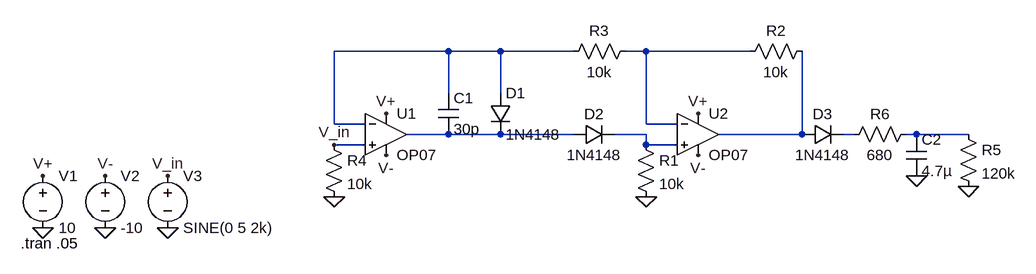
[diagram p0: schematic Draft3.asc]
Draft3.asc, the LTspice schematic file:
Version 4
SHEET 1 1280 680
WIRE 400 -16 224 -16
WIRE 480 -16 400 -16
WIRE 592 -16 480 -16
WIRE 704 -16 672 -16
WIRE 864 -16 704 -16
WIRE 400 48 400 -16
WIRE 480 48 480 -16
WIRE 224 96 224 -16
WIRE 272 96 224 96
WIRE 704 96 704 -16
WIRE 752 96 704 96
WIRE 400 112 336 112
WIRE 480 112 400 112
WIRE 592 112 480 112
WIRE 704 112 656 112
WIRE 944 112 944 -16
WIRE 944 112 816 112
WIRE 1024 112 1008 112
WIRE 1120 112 1104 112
WIRE 1200 112 1120 112
WIRE 272 128 224 128
WIRE 704 128 704 112
WIRE 752 128 704 128
FLAG -32 256 0
FLAG -128 256 0
FLAG -224 256 0
FLAG 304 80 V+
FLAG -224 176 V+
FLAG -128 176 V-
FLAG 304 144 V-
FLAG 784 144 V-
FLAG 784 80 V+
FLAG 704 208 0
FLAG 224 208 0
FLAG -32 176 V_in
FLAG 224 128 V_in
FLAG 1120 176 0
FLAG 1200 192 0
SYMBOL voltage -224 160 R0
WINDOW 123 0 0 Left 0
WINDOW 39 0 0 Left 0
SYMATTR InstName V1
SYMATTR Value 10
SYMBOL voltage -128 160 R0
WINDOW 123 0 0 Left 0
WINDOW 39 0 0 Left 0
SYMATTR InstName V2
SYMATTR Value -10
SYMBOL voltage -32 160 R0
WINDOW 123 0 0 Left 0
WINDOW 39 0 0 Left 0
SYMATTR InstName V3
SYMATTR Value SINE(0 5 2k)
SYMBOL Opamps\\OP07 304 48 R0
SYMATTR InstName U1
SYMBOL Opamps\\OP07 784 48 R0
SYMATTR InstName U2
SYMBOL cap 384 48 R0
SYMATTR InstName C1
SYMATTR Value 30p
SYMBOL diode 464 48 R0
SYMATTR InstName D1
SYMATTR Value 1N4148
SYMBOL diode 592 128 R270
WINDOW 0 32 32 VTop 2
WINDOW 3 0 32 VBottom 2
SYMATTR InstName D2
SYMATTR Value 1N4148
SYMBOL res 688 112 R0
SYMATTR InstName R1
SYMATTR Value 10k
SYMBOL res 960 -32 R90
WINDOW 0 0 56 VBottom 2
WINDOW 3 32 56 VTop 2
SYMATTR InstName R2
SYMATTR Value 10k
SYMBOL res 688 -32 R90
WINDOW 0 0 56 VBottom 2
WINDOW 3 32 56 VTop 2
SYMATTR InstName R3
SYMATTR Value 10k
SYMBOL res 208 112 R0
SYMATTR InstName R4
SYMATTR Value 10k
SYMBOL diode 944 128 R270
WINDOW 0 32 32 VTop 2
WINDOW 3 0 32 VBottom 2
SYMATTR InstName D3
SYMATTR Value 1N4148
SYMBOL cap 1104 112 R0
SYMATTR InstName C2
SYMATTR Value 4.7µ
SYMBOL res 1184 96 R0
SYMATTR InstName R5
SYMATTR Value 120k
SYMBOL res 1120 96 R90
WINDOW 0 0 56 VBottom 2
WINDOW 3 32 56 VTop 2
SYMATTR InstName R6
SYMATTR Value 680
TEXT -258 280 Left 2 !.tran .05

The netlist it stands for:
* Draft3.asc
V1 V+ 0 10
V2 V- 0 -10
V3 V_in 0 SINE(0 5 2k)
XU1 V_in N001 V+ V- N003 LT1001  ; OP07, pins In+ In- V+ V- OUT
XU2 N004 N002 V+ V- N005 LT1001  ; OP07, pins In+ In- V+ V- OUT
C1 N001 N003 30p
D1 N001 N003 1N4148
D2 N003 N004 1N4148
R1 N004 0 10k
R2 N005 N002 10k
R3 N002 N001 10k
R4 V_in 0 10k
D3 N005 N006 1N4148
C2 N007 0 4.7µ
R5 N007 0 120k
R6 N007 N006 680
.model D D
.lib standard.dio
.tran .05
.lib LTC.lib
.backanno
.end